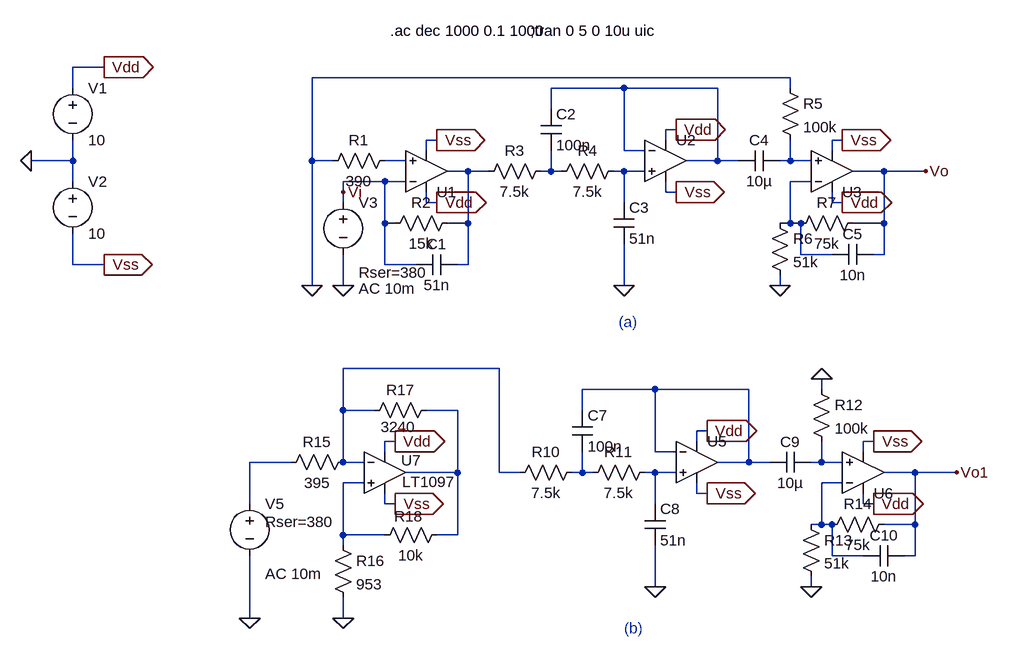
[diagram p0: schematic sensor amplifier1.asc]
sensor amplifier1.asc, the LTspice schematic file:
Version 4
SHEET 1 880 788
WIRE -544 -96 -592 -96
WIRE 512 -80 -224 -80
WIRE -592 -64 -592 -96
WIRE 256 -64 144 -64
WIRE 400 -64 256 -64
WIRE 512 -64 512 -80
WIRE 144 -32 144 -64
WIRE 336 0 320 0
WIRE -32 16 -48 16
WIRE 320 16 320 0
WIRE 592 16 576 16
WIRE -48 32 -48 16
WIRE 256 32 256 -64
WIRE 288 32 256 32
WIRE 576 32 576 16
WIRE -592 48 -592 16
WIRE -592 48 -656 48
WIRE -224 48 -224 -80
WIRE -192 48 -224 48
WIRE -80 48 -112 48
WIRE 400 48 400 -64
WIRE 400 48 352 48
WIRE 432 48 400 48
WIRE 512 48 512 16
WIRE 512 48 496 48
WIRE 544 48 512 48
WIRE 16 64 -16 64
WIRE 48 64 16 64
WIRE 144 64 144 32
WIRE 144 64 128 64
WIRE 160 64 144 64
WIRE 256 64 240 64
WIRE 288 64 256 64
WIRE 656 64 608 64
WIRE 720 64 656 64
WIRE -592 80 -592 48
WIRE -112 80 -176 80
WIRE -80 80 -112 80
WIRE 544 80 512 80
WIRE -176 96 -176 80
WIRE 320 96 320 80
WIRE 336 96 320 96
WIRE -176 112 -176 96
WIRE -48 112 -48 96
WIRE -32 112 -48 112
WIRE 256 112 256 64
WIRE 576 112 576 96
WIRE 592 112 576 112
WIRE -112 144 -112 80
WIRE -96 144 -112 144
WIRE 16 144 16 64
WIRE 16 144 -16 144
WIRE 512 144 512 80
WIRE 512 144 496 144
WIRE 528 144 512 144
WIRE 656 144 656 64
WIRE 656 144 608 144
WIRE 528 192 528 144
WIRE 576 192 528 192
WIRE 656 192 656 144
WIRE 656 192 640 192
WIRE -592 208 -592 160
WIRE -544 208 -592 208
WIRE -112 208 -112 144
WIRE -64 208 -112 208
WIRE 16 208 16 144
WIRE 16 208 0 208
WIRE -224 240 -224 48
WIRE -176 240 -176 192
WIRE 256 240 256 176
WIRE 496 240 496 224
WIRE 64 368 -176 368
WIRE 304 400 192 400
WIRE 448 400 304 400
WIRE 560 400 560 384
WIRE -176 432 -176 368
WIRE -128 432 -176 432
WIRE 0 432 -48 432
WIRE 192 432 192 400
WIRE 384 464 368 464
WIRE -96 480 -112 480
WIRE 368 480 368 464
WIRE 640 480 624 480
WIRE -112 496 -112 480
WIRE 304 496 304 400
WIRE 336 496 304 496
WIRE 624 496 624 480
WIRE -256 512 -320 512
WIRE -176 512 -176 432
WIRE -144 512 -176 512
WIRE 448 512 448 400
WIRE 448 512 400 512
WIRE 480 512 448 512
WIRE 560 512 560 480
WIRE 560 512 544 512
WIRE 592 512 560 512
WIRE 0 528 0 432
WIRE 0 528 -80 528
WIRE 64 528 64 368
WIRE 96 528 64 528
WIRE 192 528 192 496
WIRE 192 528 176 528
WIRE 208 528 192 528
WIRE 304 528 288 528
WIRE 336 528 304 528
WIRE 704 528 656 528
WIRE 768 528 704 528
WIRE -144 544 -176 544
WIRE 592 544 560 544
WIRE 368 560 368 544
WIRE 384 560 368 560
WIRE -320 576 -320 512
WIRE -112 576 -112 560
WIRE -96 576 -112 576
WIRE 304 576 304 528
WIRE 624 576 624 560
WIRE 640 576 624 576
WIRE 560 608 560 544
WIRE 560 608 544 608
WIRE 576 608 560 608
WIRE 704 608 704 528
WIRE 704 608 656 608
WIRE -176 624 -176 544
WIRE -112 624 -176 624
WIRE 0 624 0 528
WIRE 0 624 -32 624
WIRE -176 640 -176 624
WIRE 576 656 576 608
WIRE 624 656 576 656
WIRE 704 656 704 608
WIRE 704 656 688 656
WIRE 304 704 304 640
WIRE 544 704 544 688
WIRE -320 752 -320 656
WIRE -176 752 -176 720
FLAG -32 112 Vdd
IOPIN -32 112 Out
FLAG -32 16 Vss
IOPIN -32 16 Out
FLAG 336 0 Vdd
IOPIN 336 0 Out
FLAG 336 96 Vss
IOPIN 336 96 Out
FLAG 592 112 Vdd
IOPIN 592 112 Out
FLAG 592 16 Vss
IOPIN 592 16 Out
FLAG -656 48 0
FLAG -544 -96 Vdd
IOPIN -544 -96 Out
FLAG -544 208 Vss
IOPIN -544 208 Out
FLAG 256 240 0
FLAG -224 240 0
FLAG 496 240 0
FLAG -176 240 0
FLAG 720 64 Vo
FLAG -176 96 Vi
FLAG 384 464 Vdd
IOPIN 384 464 Out
FLAG 384 560 Vss
IOPIN 384 560 Out
FLAG 640 576 Vdd
IOPIN 640 576 Out
FLAG 640 480 Vss
IOPIN 640 480 Out
FLAG 304 704 0
FLAG 544 704 0
FLAG 768 528 Vo1
FLAG 560 384 0
FLAG -96 480 Vdd
IOPIN -96 480 Out
FLAG -96 576 Vss
IOPIN -96 576 Out
FLAG -176 752 0
FLAG -320 752 0
SYMBOL res -96 32 R90
WINDOW 0 0 56 VBottom 2
WINDOW 3 32 56 VTop 2
SYMATTR InstName R1
SYMATTR Value 390
SYMBOL res 0 128 R90
WINDOW 0 0 56 VBottom 2
WINDOW 3 32 56 VTop 2
SYMATTR InstName R2
SYMATTR Value 15k
SYMBOL cap 0 192 R90
WINDOW 0 0 32 VBottom 2
WINDOW 3 32 32 VTop 2
SYMATTR InstName C1
SYMATTR Value 51n
SYMBOL voltage -592 -80 R0
WINDOW 123 0 0 Left 0
WINDOW 39 0 0 Left 0
SYMATTR InstName V1
SYMATTR Value 10
SYMBOL voltage -592 64 R0
WINDOW 123 0 0 Left 0
WINDOW 39 0 0 Left 0
SYMATTR InstName V2
SYMATTR Value 10
SYMBOL res 144 48 R90
WINDOW 0 0 56 VBottom 2
WINDOW 3 32 56 VTop 2
SYMATTR InstName R3
SYMATTR Value 7.5k
SYMBOL res 256 48 R90
WINDOW 0 0 56 VBottom 2
WINDOW 3 32 56 VTop 2
SYMATTR InstName R4
SYMATTR Value 7.5k
SYMBOL cap 128 -32 R0
SYMATTR InstName C2
SYMATTR Value 100n
SYMBOL cap 240 112 R0
SYMATTR InstName C3
SYMATTR Value 51n
SYMBOL cap 496 32 R90
WINDOW 0 0 32 VBottom 2
WINDOW 3 32 32 VTop 2
SYMATTR InstName C4
SYMATTR Value 10µ
SYMBOL res 496 -80 R0
SYMATTR InstName R5
SYMATTR Value 100k
SYMBOL res 480 128 R0
SYMATTR InstName R6
SYMATTR Value 51k
SYMBOL res 624 128 R90
WINDOW 0 0 56 VBottom 2
WINDOW 3 32 56 VTop 2
SYMATTR InstName R7
SYMATTR Value 75k
SYMBOL cap 640 176 R90
WINDOW 0 0 32 VBottom 2
WINDOW 3 32 32 VTop 2
SYMATTR InstName C5
SYMATTR Value 10n
SYMBOL voltage -176 96 R0
WINDOW 3 24 152 Left 2
WINDOW 123 24 149 Left 2
WINDOW 39 24 124 Left 2
SYMATTR Value ""
SYMATTR Value2 AC 10m
SYMATTR SpiceLine Rser=380
SYMATTR InstName V3
SYMBOL OpAmps\\UniversalOpamp2 -48 64 M180
SYMATTR InstName U1
SYMBOL OpAmps\\UniversalOpamp2 320 48 R0
SYMATTR InstName U2
SYMBOL OpAmps\\UniversalOpamp2 576 64 M180
SYMATTR InstName U3
SYMBOL res 192 512 R90
WINDOW 0 0 56 VBottom 2
WINDOW 3 32 56 VTop 2
SYMATTR InstName R10
SYMATTR Value 7.5k
SYMBOL res 304 512 R90
WINDOW 0 0 56 VBottom 2
WINDOW 3 32 56 VTop 2
SYMATTR InstName R11
SYMATTR Value 7.5k
SYMBOL cap 176 432 R0
SYMATTR InstName C7
SYMATTR Value 100n
SYMBOL cap 288 576 R0
SYMATTR InstName C8
SYMATTR Value 51n
SYMBOL cap 544 496 R90
WINDOW 0 0 32 VBottom 2
WINDOW 3 32 32 VTop 2
SYMATTR InstName C9
SYMATTR Value 10µ
SYMBOL res 544 384 R0
SYMATTR InstName R12
SYMATTR Value 100k
SYMBOL res 528 592 R0
SYMATTR InstName R13
SYMATTR Value 51k
SYMBOL res 672 592 R90
WINDOW 0 0 56 VBottom 2
WINDOW 3 32 56 VTop 2
SYMATTR InstName R14
SYMATTR Value 75k
SYMBOL cap 688 640 R90
WINDOW 0 0 32 VBottom 2
WINDOW 3 32 32 VTop 2
SYMATTR InstName C10
SYMATTR Value 10n
SYMBOL OpAmps\\UniversalOpamp2 368 512 R0
SYMATTR InstName U5
SYMBOL OpAmps\\UniversalOpamp2 624 528 M180
SYMATTR InstName U6
SYMBOL voltage -320 560 R0
WINDOW 123 24 124 Left 2
WINDOW 39 24 44 Left 2
SYMATTR Value2 AC 10m
SYMATTR SpiceLine Rser=380
SYMATTR InstName V5
SYMATTR Value ""
SYMBOL OpAmps\\LT1097 -112 464 R0
WINDOW 0 25 45 Left 2
WINDOW 3 27 78 Left 2
SYMATTR InstName U7
SYMBOL res -160 496 R90
WINDOW 0 0 56 VBottom 2
WINDOW 3 32 56 VTop 2
SYMATTR InstName R15
SYMATTR Value 395
SYMBOL res -192 624 R0
SYMATTR InstName R16
SYMATTR Value 953
SYMBOL res -32 416 R90
WINDOW 0 0 56 VBottom 2
WINDOW 3 26 59 VTop 2
SYMATTR InstName R17
SYMATTR Value 3240
SYMBOL res -16 608 R90
WINDOW 0 3 59 VBottom 2
WINDOW 3 32 56 VTop 2
SYMATTR InstName R18
SYMATTR Value 10k
TEXT -104 -152 Left 2 !.ac dec 1000 0.1 1000
TEXT 112 -152 Left 2 !;tran 0 5 0 10u uic
TEXT 248 296 Left 2 ;(a)
TEXT 256 768 Left 2 ;(b)

The netlist it stands for:
* sensor amplifier1.asc
R1 N002 0 390
R2 N004 Vi 15k
C1 N004 Vi 51n
V1 Vdd 0 10
V2 0 Vss 10
R3 N005 N004 7.5k
R4 N006 N005 7.5k
C2 N001 N005 100n
C3 N006 0 51n
C4 N003 N001 10µ
R5 0 N003 100k
R6 N007 0 51k
R7 Vo N007 75k
C5 Vo N007 10n
V3 Vi 0 AC 10m Rser=380
XU1 N002 Vi Vdd Vss N004 level.2 Avol=1Meg GBW=10Meg Slew=10Meg ilimit=25m rail=0 Vos=0 phimargin=45 en=0 enk=0 in=0 ink=0 Rin=500Meg  ; pins IN+ IN- V+ V- OUT
XU2 N006 N001 Vdd Vss N001 level.2 Avol=1Meg GBW=10Meg Slew=10Meg ilimit=25m rail=0 Vos=0 phimargin=45 en=0 enk=0 in=0 ink=0 Rin=500Meg  ; pins IN+ IN- V+ V- OUT
XU3 N003 N007 Vdd Vss Vo level.2 Avol=1Meg GBW=10Meg Slew=10Meg ilimit=25m rail=0 Vos=0 phimargin=45 en=0 enk=0 in=0 ink=0 Rin=500Meg  ; pins IN+ IN- V+ V- OUT
R10 N013 N008 7.5k
R11 N014 N013 7.5k
C7 N009 N013 100n
C8 N014 0 51n
C9 N012 N009 10µ
R12 0 N012 100k
R13 N016 0 51k
R14 Vo1 N016 75k
C10 Vo1 N016 10n
XU5 N014 N009 Vdd Vss N009 level.2 Avol=1Meg GBW=10Meg Slew=10Meg ilimit=25m rail=0 Vos=0 phimargin=45 en=0 enk=0 in=0 ink=0 Rin=500Meg  ; pins IN+ IN- V+ V- OUT
XU6 N012 N016 Vdd Vss Vo1 level.2 Avol=1Meg GBW=10Meg Slew=10Meg ilimit=25m rail=0 Vos=0 phimargin=45 en=0 enk=0 in=0 ink=0 Rin=500Meg  ; pins IN+ IN- V+ V- OUT
V5 N011 0 AC 10m Rser=380
XU7 N015 N008 Vdd Vss N010 LT1097  ; pins In+ In- V+ V- OUT
R15 N008 N011 395
R16 N015 0 953
R17 N010 N008 3240
R18 N010 N015 10k
.ac dec 1000 0.1 1000
;tran 0 5 0 10u uic
* (a)
* (b)
.lib UniversalOpamps2.sub
.backanno
.end